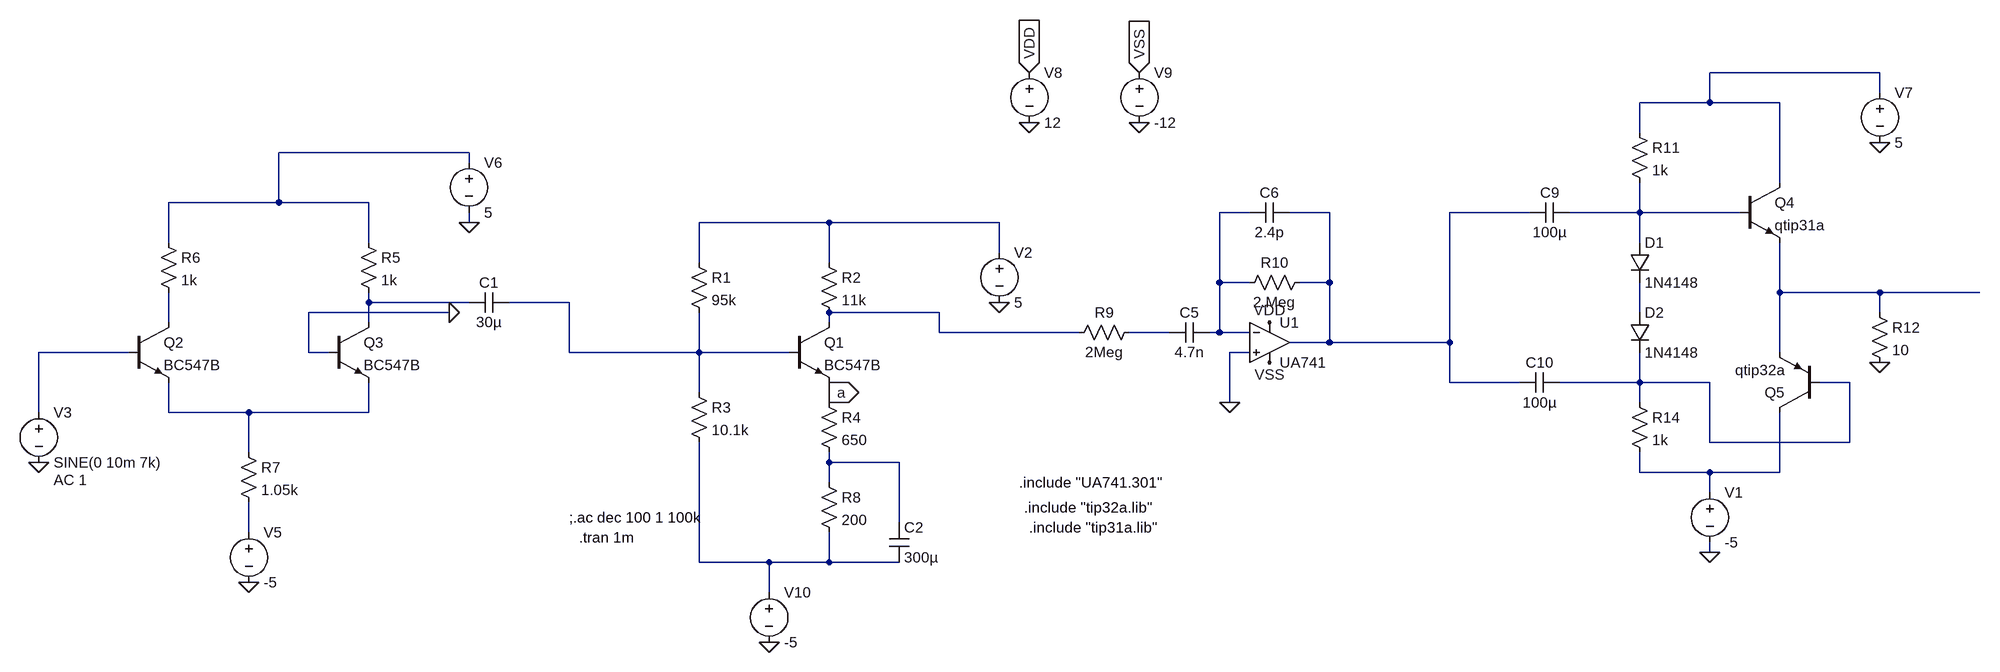
[diagram p0: schematic Final circuit.asc]
Final circuit.asc, the LTspice schematic file:
Version 4.1
SHEET 1 2164 728
WIRE 2000 -224 1728 -224
WIRE 2000 -192 2000 -224
WIRE 1728 -176 1728 -224
WIRE 1728 -176 1616 -176
WIRE 1840 -176 1728 -176
WIRE 1616 -128 1616 -176
WIRE -256 -96 -560 -96
WIRE -256 -80 -256 -96
WIRE 1840 -48 1840 -176
WIRE -560 -16 -560 -96
WIRE -560 -16 -736 -16
WIRE -416 -16 -560 -16
WIRE 992 0 944 0
WIRE 1120 0 1056 0
WIRE 1440 0 1312 0
WIRE 1616 0 1616 -48
WIRE 1616 0 1504 0
WIRE 1776 0 1616 0
WIRE -256 16 -256 0
WIRE 320 16 112 16
WIRE 592 16 320 16
WIRE -736 48 -736 -16
WIRE -416 48 -416 -16
WIRE 1616 48 1616 0
WIRE 592 64 592 16
WIRE 112 80 112 16
WIRE 320 80 320 16
WIRE 944 112 944 0
WIRE 992 112 944 112
WIRE 1120 112 1120 0
WIRE 1120 112 1072 112
WIRE 1840 128 1840 48
WIRE 2000 128 1840 128
WIRE 2160 128 2000 128
WIRE -416 144 -416 128
WIRE -256 144 -416 144
WIRE -96 144 -192 144
WIRE -288 160 -512 160
WIRE 496 160 320 160
WIRE 1616 160 1616 112
WIRE 2000 160 2000 128
WIRE -736 176 -736 128
WIRE -416 176 -416 144
WIRE 320 176 320 160
WIRE 496 192 496 160
WIRE 720 192 496 192
WIRE 864 192 800 192
WIRE 944 192 944 112
WIRE 944 192 928 192
WIRE 992 192 944 192
WIRE 1120 208 1120 112
WIRE 1120 208 1056 208
WIRE 1312 208 1312 0
WIRE 1312 208 1120 208
WIRE -800 224 -944 224
WIRE -512 224 -512 160
WIRE -480 224 -512 224
WIRE -96 224 -96 144
WIRE 112 224 112 160
WIRE 112 224 -96 224
WIRE 256 224 112 224
WIRE 992 224 960 224
WIRE 1840 224 1840 128
WIRE 1312 272 1312 208
WIRE 1424 272 1312 272
WIRE 1616 272 1616 224
WIRE 1616 272 1488 272
WIRE 1728 272 1616 272
WIRE 1952 272 1904 272
WIRE 112 288 112 224
WIRE 320 288 320 272
WIRE 320 304 320 288
WIRE 960 304 960 224
WIRE 1616 304 1616 272
WIRE -944 320 -944 224
WIRE -736 320 -736 272
WIRE -608 320 -736 320
WIRE -416 320 -416 272
WIRE -416 320 -608 320
WIRE 1728 368 1728 272
WIRE 1952 368 1952 272
WIRE 1952 368 1728 368
WIRE -608 384 -608 320
WIRE 320 400 320 384
WIRE 432 400 320 400
WIRE 1616 416 1616 384
WIRE 1728 416 1616 416
WIRE 1840 416 1840 320
WIRE 1840 416 1728 416
WIRE 320 432 320 400
WIRE 1728 448 1728 416
WIRE 432 496 432 400
WIRE -608 512 -608 464
WIRE 1728 544 1728 528
WIRE 112 560 112 368
WIRE 224 560 112 560
WIRE 320 560 320 512
WIRE 320 560 224 560
WIRE 432 560 320 560
WIRE 224 608 224 560
FLAG 592 144 0
FLAG -256 16 0
FLAG -608 592 0
FLAG -944 400 0
FLAG 960 304 0
FLAG 2000 -112 0
FLAG 2000 240 0
FLAG 640 -144 0
FLAG 816 -144 0
FLAG 640 -224 VDD
IOPIN 640 -224 In
FLAG 816 -224 VSS
IOPIN 816 -224 In
FLAG 1024 176 VDD
FLAG 1024 240 VSS
FLAG 224 688 0
FLAG 1728 544 0
FLAG -288 160 0
FLAG 320 288 a
IOPIN 320 288 Out
SYMBOL res 96 64 R0
SYMATTR InstName R1
SYMATTR Value 95k
SYMBOL res 304 64 R0
SYMATTR InstName R2
SYMATTR Value 11k
SYMBOL res 96 272 R0
SYMATTR InstName R3
SYMATTR Value 10.1k
SYMBOL res 304 288 R0
SYMATTR InstName R4
SYMATTR Value 650
SYMBOL voltage 592 48 R0
WINDOW 123 0 0 Left 0
WINDOW 39 0 0 Left 0
SYMATTR InstName V2
SYMATTR Value 5
SYMBOL cap -192 128 R90
WINDOW 0 0 32 VBottom 2
WINDOW 3 32 32 VTop 2
SYMATTR InstName C1
SYMATTR Value 30µ
SYMBOL npn 256 176 R0
SYMATTR InstName Q1
SYMATTR Value BC547B
SYMBOL npn -800 176 R0
SYMATTR InstName Q2
SYMATTR Value BC547B
SYMBOL npn -480 176 R0
SYMATTR InstName Q3
SYMATTR Value BC547B
SYMBOL voltage -944 304 R0
WINDOW 123 24 124 Left 2
WINDOW 39 0 0 Left 0
SYMATTR Value2 AC 1
SYMATTR InstName V3
SYMATTR Value SINE(0 10m 7k)
SYMBOL voltage -608 496 R0
WINDOW 123 0 0 Left 0
WINDOW 39 0 0 Left 0
SYMATTR InstName V5
SYMATTR Value -5
SYMBOL voltage -256 -96 R0
WINDOW 123 0 0 Left 0
WINDOW 39 0 0 Left 0
SYMATTR InstName V6
SYMATTR Value 5
SYMBOL res -432 32 R0
SYMATTR InstName R5
SYMATTR Value 1k
SYMBOL res -752 32 R0
SYMATTR InstName R6
SYMATTR Value 1k
SYMBOL res -624 368 R0
SYMATTR InstName R7
SYMATTR Value 1.05k
SYMBOL OpAmps\\opamp2 1024 144 R0
SYMATTR InstName U1
SYMATTR Value UA741
SYMBOL res 816 176 R90
WINDOW 0 0 56 VBottom 2
WINDOW 3 32 56 VTop 2
SYMATTR InstName R9
SYMATTR Value 2Meg
SYMBOL res 1088 96 R90
WINDOW 0 0 56 VBottom 2
WINDOW 3 32 56 VTop 2
SYMATTR InstName R10
SYMATTR Value 2.Meg
SYMBOL cap 928 176 R90
WINDOW 0 0 32 VBottom 2
WINDOW 3 32 32 VTop 2
SYMATTR InstName C5
SYMATTR Value 4.7n
SYMBOL cap 1056 -16 R90
WINDOW 0 0 32 VBottom 2
WINDOW 3 32 32 VTop 2
SYMATTR InstName C6
SYMATTR Value 2.4p
SYMBOL npn 1776 -48 R0
SYMATTR InstName Q4
SYMATTR Value qtip31a
SYMBOL pnp 1904 320 R180
SYMATTR InstName Q5
SYMATTR Value qtip32a
SYMBOL res 1600 -144 R0
SYMATTR InstName R11
SYMATTR Value 1k
SYMBOL res 1600 288 R0
SYMATTR InstName R14
SYMATTR Value 1k
SYMBOL voltage 2000 -208 R0
WINDOW 123 0 0 Left 0
WINDOW 39 0 0 Left 0
SYMATTR InstName V7
SYMATTR Value 5
SYMBOL diode 1600 48 R0
SYMATTR InstName D1
SYMATTR Value 1N4148
SYMBOL diode 1600 160 R0
SYMATTR InstName D2
SYMATTR Value 1N4148
SYMBOL res 1984 144 R0
SYMATTR InstName R12
SYMATTR Value 10
SYMBOL voltage 640 -240 R0
WINDOW 123 0 0 Left 0
WINDOW 39 0 0 Left 0
SYMATTR InstName V8
SYMATTR Value 12
SYMBOL voltage 816 -240 R0
WINDOW 123 0 0 Left 0
WINDOW 39 0 0 Left 0
SYMATTR InstName V9
SYMATTR Value -12
SYMBOL voltage 224 592 R0
WINDOW 123 0 0 Left 0
WINDOW 39 0 0 Left 0
SYMATTR InstName V10
SYMATTR Value -5
SYMBOL voltage 1728 432 R0
WINDOW 123 0 0 Left 0
WINDOW 39 0 0 Left 0
SYMATTR InstName V1
SYMATTR Value -5
SYMBOL cap 1504 -16 R90
WINDOW 0 0 32 VBottom 2
WINDOW 3 32 32 VTop 2
SYMATTR InstName C9
SYMATTR Value 100µ
SYMBOL cap 1488 256 R90
WINDOW 0 0 32 VBottom 2
WINDOW 3 32 32 VTop 2
SYMATTR InstName C10
SYMATTR Value 100µ
SYMBOL res 304 416 R0
SYMATTR InstName R8
SYMATTR Value 200
SYMBOL cap 416 496 R0
SYMATTR InstName C2
SYMATTR Value 300µ
TEXT -96 488 Left 2 !;.ac dec 100 1 100k
TEXT 624 432 Left 2 !.include "UA741.301"
TEXT 632 472 Left 2 !.include "tip32a.lib"
TEXT 640 504 Left 2 !.include "tip31a.lib"
TEXT -80 520 Left 2 !.tran 1m

The netlist it stands for:
* Final circuit.asc
R1 N006 N009 95k
R2 N006 N010 11k
R3 N009 N020 10.1k
R4 a N017 650
V2 N006 0 5
C1 N009 N008 30µ
Q1 N010 N009 a 0 BC547B
Q2 N012 N014 N016 0 BC547B
Q3 N008 0 N016 0 BC547B
V3 N014 0 SINE(0 10m 7k) AC 1
V5 N019 0 -5
V6 N002 0 5
R5 N002 N008 1k
R6 N002 N012 1k
R7 N016 N019 1.05k
X§U1 0 N003 VDD VSS N004 UA741  ; pins In+ In- V+ V- OUT
R9 N013 N010 2Meg
R10 N004 N003 2.Meg
C5 N003 N013 4.7n
C6 N004 N003 2.4p
Q4 N001 N005 N007 0 qtip31a
Q5 N018 N015 N007 0 qtip32a
R11 N001 N005 1k
R14 N015 N018 1k
V7 N001 0 5
D1 N005 N011 1N4148
D2 N011 N015 1N4148
R12 N007 0 10
V8 VDD 0 12
V9 VSS 0 -12
V10 N020 0 -5
V1 N018 0 -5
C9 N005 N004 100µ
C10 N015 N004 100µ
R8 N017 N020 200
C2 N017 N020 300µ
.model D D
.lib standard.dio
.model NPN NPN
.model PNP PNP
.lib standard.bjt
;.ac dec 100 1 100k
.include "UA741.301"
.include "tip32a.lib"
.include "tip31a.lib"
.tran 1m
.backanno
.end